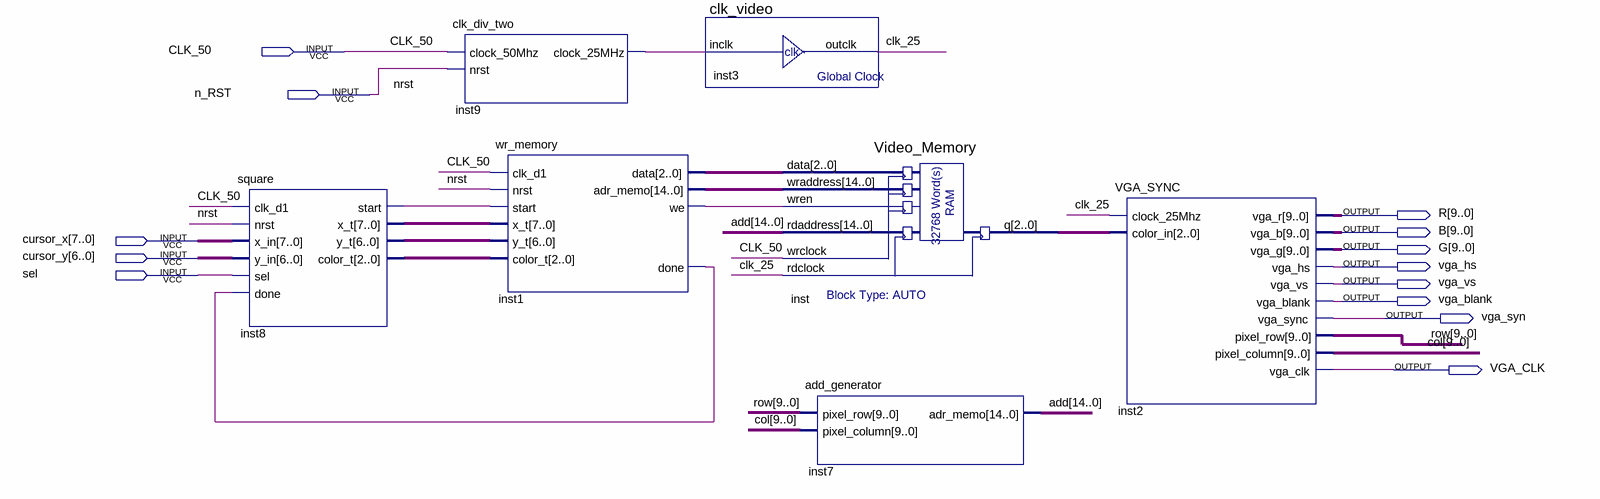
[diagram p0: schematic sheet]
// Quartus schematic VGA_visualisation.bdf as structural Verilog: 7 symbols, 13 pins
module VGA_visualisation (
  input  CLK_50,
  input  n_RST,
  input  [7:0] cursor_x,
  input  [6:0] cursor_y,
  input  sel,
  output [9:0] R,
  output [9:0] B,
  output [9:0] G,
  output vga_hs,
  output vga_vs,
  output vga_blank,
  output vga_syn,
  output VGA_CLK
);

  wire clk_25, inst1_done, inst1_we, inst8_start, inst9_clock_25mhz;
  wire [2:0] inst1_data, inst8_color_t, inst_q;
  wire [6:0] inst8_y_t;
  wire [7:0] inst8_x_t;
  wire [9:0] col, row;
  wire [14:0] add, inst1_adr_memo;

  square inst8 (
    .clk_d1(CLK_50), .nrst(n_RST), .x_in(cursor_x), .y_in(cursor_y), .sel(sel), .done(inst1_done),
    .start(inst8_start), .x_t(inst8_x_t), .y_t(inst8_y_t), .color_t(inst8_color_t));
  clk_div_two inst9 (.clock_50Mhz(CLK_50), .nrst(n_RST), .clock_25MHz(inst9_clock_25mhz));
  wr_memory inst1 (
    .clk_d1(CLK_50), .start(inst8_start), .nrst(n_RST), .x_t(inst8_x_t), .y_t(inst8_y_t),
    .color_t(inst8_color_t), .we(inst1_we), .done(inst1_done), .data(inst1_data), .adr_memo(inst1_adr_memo));
  clk_video inst3 (.inclk(inst9_clock_25mhz), .outclk(clk_25));
  Video_Memory inst (
    .data(inst1_data), .wraddress(inst1_adr_memo), .wren(inst1_we), .rdaddress(add), .wrclock(CLK_50),
    .rdclock(clk_25), .q(inst_q));
  add_generator inst7 (.pixel_row(row), .pixel_column(col), .adr_memo(add));
  VGA_SYNC inst2 (
    .clock_25Mhz(clk_25), .color_in(inst_q), .vga_r(R), .vga_b(B), .vga_g(G), .vga_hs(vga_hs),
    .vga_vs(vga_vs), .vga_blank(vga_blank), .vga_sync(vga_syn), .pixel_row(row), .pixel_column(col),
    .vga_clk(VGA_CLK));

  // Other names for the same wires on the sheet: nrst = n_RST
endmodule
